# EAGLE design USB-HID (EAGLE 5.11)
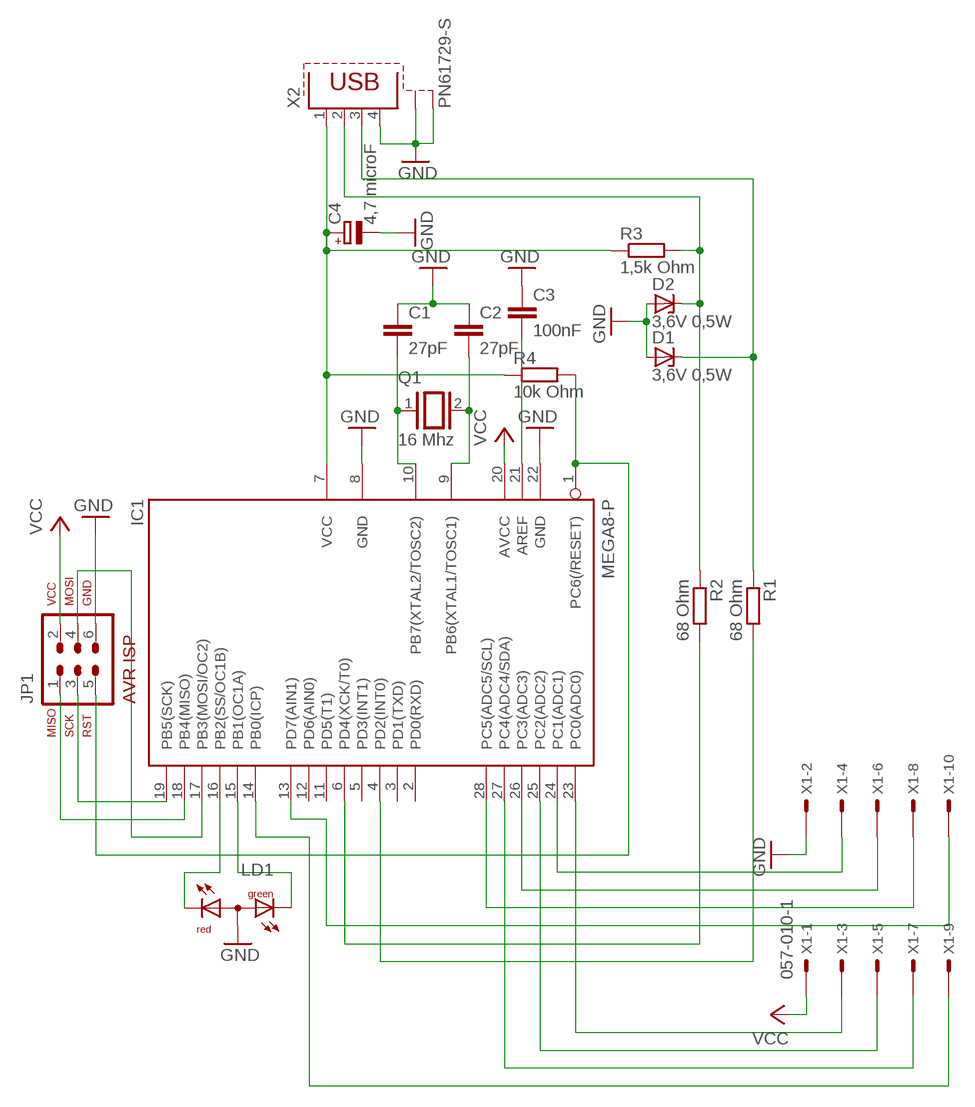
[diagram p0: schematic, sheet 1]

## Parts
C1  27pF  C2.5/2  [C2.5-2]
C2  27pF  C2.5/2  [C2.5-2]
C3  100nF  C2.5/2  [C2.5-2]
C4  4,7 microF  CPOL-EUE1.8-4  [E1,8-4]
D1  3,6V 0,5W  ZPD  [DO35Z10]
D2  3,6V 0,5W  ZPD  [DO35Z10]
IC1  MEGA8-P  [DIL28-3]
JP1  AVR-ISP-6VERT  [AVR-ISP-6]
LD1  DUOLED-RG-A  [DUOLED-A-5MM]
Q1  16 Mhz  XTAL/S  [QS]
R1  68 Ohm  R-EU_0204/7  [0204/7]
R2  68 Ohm  R-EU_0204/7  [0204/7]
R3  1,5k Ohm  R-EU_0204/7  [0204/7]
R4  10k Ohm  R-EU_0204/7  [0204/7]
X1  057-010-1  [057-010-1]
X2  PN61729-S  [PN61729-S]

## Nets
GND: C1.1 C2.1 C3.1 C4.- D1.A D2.A IC1.8(GND) IC1.22(GND) JP1.6 LD1.A X1.2 X2.4 X2.S1 X2.S2
N$1: C3.2 IC1.21(AREF)
N$2: C4.+ IC1.7(VCC) R3.1 R4.1 X2.1
N$4: D2.C R2.1 R3.2 X2.2
N$21: D1.C R1.1 X2.3
PB0: IC1.14(PB0(ICP)) X1.9
PB1: IC1.15(PB1(OC1A)) LD1.CX(CG)
PB2: IC1.16(PB2(SS/OC1B)) LD1.CR
PB3(MOSI): IC1.17(PB3(MOSI/OC2)) JP1.4
PB4(MISO): IC1.18(PB4(MISO)) JP1.1
PB5(SCK): IC1.19(PB5(SCK)) JP1.3
PB6(XTAL1): C2.2 IC1.9(PB6(XTAL1/TOSC1)) Q1.2
PB7(XTAL2): C1.2 IC1.10(PB7(XTAL2/TOSC2)) Q1.1
PC0: IC1.23(PC0(ADC0)) X1.3
PC1: IC1.24(PC1(ADC1)) X1.4
PC2: IC1.25(PC2(ADC2)) X1.5
PC3: IC1.26(PC3(ADC3)) X1.6
PC4: IC1.27(PC4(ADC4/SDA)) X1.7
PC5: IC1.28(PC5(ADC5/SCL)) X1.8
PC6(RESET): IC1.1(PC6(/RESET)) JP1.5 R4.2
PD7: IC1.13(PD7(AIN1)) X1.10
USB_D+: IC1.4(PD2(INT0)) R1.2
USB_D-: IC1.6(PD4(XCK/T0)) R2.2
VCC: IC1.20(AVCC) JP1.2 X1.1
Unconnected: IC1.2(PD0(RXD)) IC1.3(PD1(TXD)) IC1.5(PD3(INT1)) IC1.11(PD5(T1)) IC1.12(PD6(AIN0))

## Library data of the parts
C1-C3 = capacitor-wima:C: CAPACITOR naming: grid - package width
C4 = rcl:CPOL-EU: POLARIZED CAPACITOR, European symbol
D1 D2 = diode:ZPD: Z DIODE 500 mW
IC1 = atmel:MEGA8-P: MICROCONTROLLER 8 Kbytes FLASH, 1 kbytes SRAM, 512 bytes EEPROM, USART, 4-channel 10 bit ADC, 2-channel 8 bit ADC Pin compatible with Atmega48, ATMega88, ATMega168 Source: avr.lbr; OC_FARNELL: unknown; OC_NEWARK: unknown
JP1 = avr-7:AVR-ISP-6: AVR ISP-6 Serial Programming Header
LD1 = led:DUOLED-RG-A: DUO LED 2 colors (red/green), 5 mm, round, common Anode www.ligitek.com or other producers.
Q1 = special:XTAL/S: CRYSTAL
R1-R4 = resistor:R-EU_: RESISTOR, European symbol
X1 = con-panduit:057-010-: CONNECTOR 10-pin series 057 contact pc board low profile headers; OC_FARNELL: unknown; OC_NEWARK: unknown
X2 = con-berg:PN61729-S: BERG USB connector; OC_FARNELL: unknown; OC_NEWARK: unknown

## Board
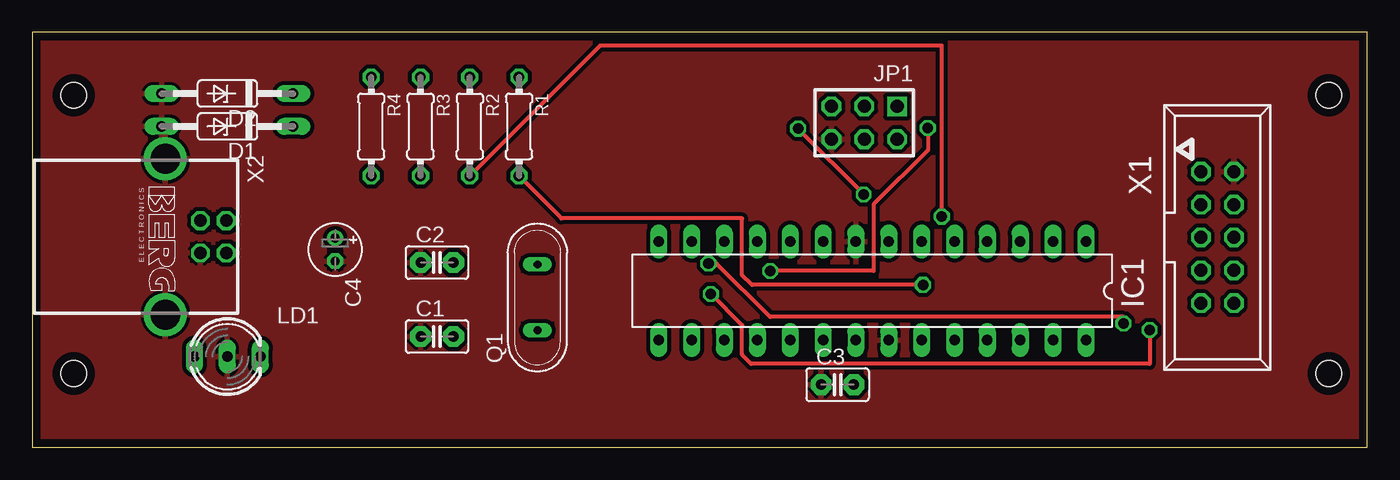
[diagram p1: board, top side]
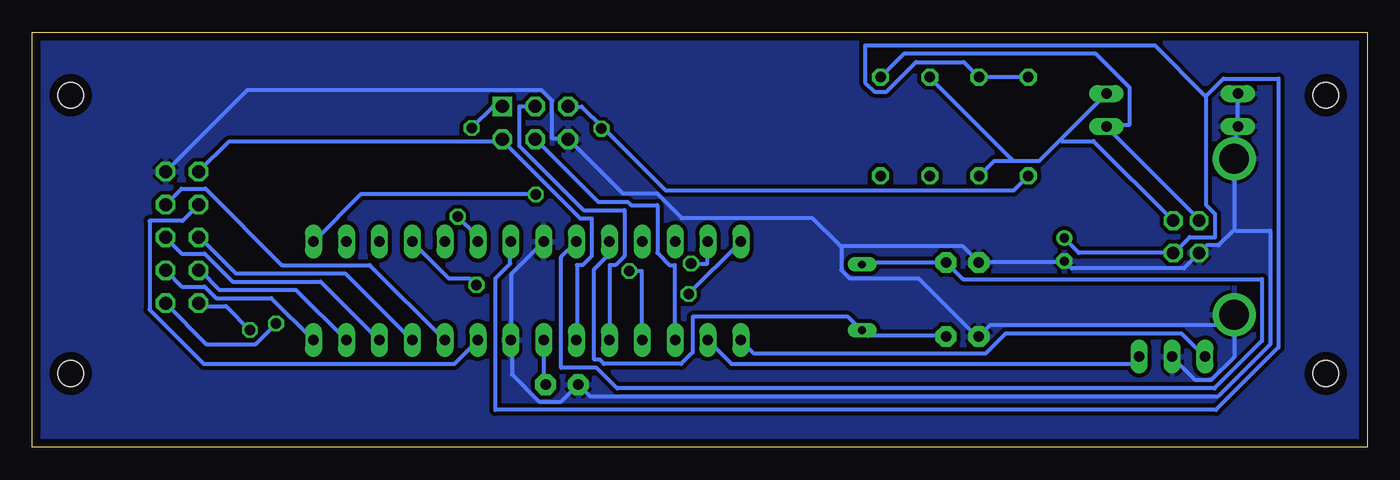
[diagram p2: board, bottom side, seen from below]

Size 103.17 x 32.05 mm. Coordinates in mm from the lower left corner, seen from the top.
Outline: 0,0 103.17,0 103.17,32.05 0,32.05 0,0
Copper layers (1*16): Top 0.035mm / dielectric 1.5mm / Bottom 0.035mm
Design rules: minimum track width 12mil, minimum drill 32mil, track to track 12mil, track to pad 12mil, pad to pad 12mil, via to via 12mil, smd to smd 12mil, copper to edge 25mil, drill to drill 10mil, minimum pad ring 10mil, minimum via ring 8mil, stop-mask expansion 4mil, vias tented up to drill 0mil, thermal gap 10mil
Holes 2 mm at 3.2,5.7 3.2,27.2 100.2,5.7 100.2,27.2
tRestrict: area 22.8,14 to 24,16.5; area 14.4,5.7 to 15.7,8.3; area 17,5.7 to 18.2,8.3; area 11.9,5.7 to 13.2,8.3; area 22.8,14 to 24,16.5; area 37.8,13.5 to 40.3,14.8; area 37.8,8.4 to 40.3,9.7; area 66.2,25.7 to 67.5,27; area 66.2,23.2 to 67.5,24.4; area 63.7,23.2 to 64.9,24.4; area 63.7,25.7 to 64.9,27; area 61.1,25.7 to 62.4,27; 48 more areas
vRestrict: area 36.5,5.9 to 41.6,17.3; area 21.3,13 to 25.8,17.5; area 87,5.4 to 96.2,26.7; area 60,22.2 to 68.6,27.9

### Footprints (pad centres in the part's own frame; a part is rotated, then mirrored left to right if it is on the bottom)
C2.5-2 = drill 0.813 pad 1.6 octagon: 1 -1.27,0; 2 1.27,0
E1,8-4 = drill 0.711 pad 1.168: + -0.889,0 | drill 0.711 pad 1.168 octagon: - 0.889,0
DO35Z10 = drill 0.813 long: A 5.08,0; C -5.08,0
DIL28-3 = drill 0.813 long: 1 -16.51,-3.81; 2 -13.97,-3.81; 3 -11.43,-3.81; 4 -8.89,-3.81; 5 -6.35,-3.81; 6 -3.81,-3.81; 7 -1.27,-3.81; 8 1.27,-3.81; 9 3.81,-3.81; 10 6.35,-3.81; 11 8.89,-3.81; 12 11.43,-3.81; 13 13.97,-3.81; 14 16.51,-3.81; 15 16.51,3.81; 16 13.97,3.81; 17 11.43,3.81; 18 8.89,3.81; 19 6.35,3.81; 20 3.81,3.81; 21 1.27,3.81; 22 -1.27,3.81; 23 -3.81,3.81; 24 -6.35,3.81; 25 -8.89,3.81; 26 -11.43,3.81; 27 -13.97,3.81; 28 -16.51,3.81
AVR-ISP-6 = drill 1.016 square: 1 -2.54,-1.27 | drill 1.016 octagon: 2 -2.54,1.27; 3 0,-1.27; 4 0,1.27; 5 2.54,-1.27; 6 2.54,1.27
DUOLED-A-5MM = drill 0.813 long: A 0,0; CR 2.54,0; CX -2.54,0
QS = drill 0.61 long: 1 -2.54,0; 2 2.54,0
0204/7 = drill 0.813 octagon: 1 -3.81,0; 2 3.81,0
057-010-1 = drill 1 octagon: 1 -5.08,-1.27; 2 -5.08,1.27; 3 -2.54,-1.27; 4 -2.54,1.27; 5 0,-1.27; 6 0,1.27; 7 2.54,-1.27; 8 2.54,1.27; 9 5.08,-1.27; 10 5.08,1.27
PN61729-S = drill 0.95 octagon: 1 1.25,4.71; 2 -1.25,4.71; 3 -1.25,2.71; 4 1.25,2.71 | drill 2.3 pad 2.9: S1 -6.02,0; S2 6.02,0

### Placement (x,y rotation side)
C1  31.28,8.55 0 top
C2  31.28,14.27 0 top
C3  62.23,4.84 0 top
C4  23.4,15.27 270 top
D1  15.08,24.78 180 top
D2  15.08,27.32 180 top
IC1  64.92,12.08 180 top
JP1  64.3,25.07 180 top
LD1  15.08,7 0 top
Q1  39.04,11.58 90 top
R1  37.62,24.78 270 top
R2  33.81,24.78 270 top
R3  30,24.78 270 top
R4  26.19,24.78 270 top
X1  91.59,16.21 270 top
X2  10.28,16.26 270 top

### Tracks (layer width: path | path; a pad name or v marks a point on that pad's centre or on a via)
GND
  Bottom 0.305: X1.2 92.84,21.31 86.55,27.59 63.82,27.59 62.99,26.77 62.99,23.85 61.78,23.85 JP1.6 61.66,23.72 57.53,19.59 54.86,19.59 52.96,17.69 42.86,17.69 40.77,15.59 40.64,15.53 | LD1.A 15.05,6.96 13.27,5.18 12.06,5.18 10.29,6.96 10.29,10.2 X2.S2 10.41,9.43 29.15,9.43 29.97,8.61 C1.1 30.16,8.54 34.67,13.05 40,13.05 40.64,13.69 40.64,15.53 | IC1.8 63.69,15.85 66.17,13.37 66.17,8.29 IC1.22 66.1,8.16 66.1,5.62 64.01,3.53 62.29,3.53 61.02,4.8 C3.1 60.83,4.73 60.01,3.91 11.56,3.91 7.49,7.97 7.49,16.74 10.16,16.74 10.29,16.8 | D2.A 10.03,27.28 10.03,24.8 D1.A 10.1,24.67 10.1,22.39 10.22,22.39 X2.S1 10.29,22.26 10.29,16.8 | 10.29,16.8 11.49,15.59 12.38,15.59 12.95,15.02 X2.4 13.08,14.89 14.16,13.82 22.86,13.82 23.3,14.26 C4.- 23.43,14.32 29.97,14.32 C2.1 30.1,14.39 31.24,15.53 40.64,15.53
  pour Bottom: -5.55,37.51 111.86,37.51 111.86,-11.99 -5.57,-11.99 -5.57,37.59
  pour Top: -1.87,34.14 107.23,34.14 107.23,-7.11 -1.79,-7.11
N$1
  Bottom 0.305: IC1.21 63.63,8.23 63.63,4.86 63.56,4.86 C3.2
N$2
  Bottom 0.305: R4.1 26.23,28.61 29.97,28.61 R3.1 30.1,28.67 31.18,29.75 34.86,29.75 37.15,27.47 38.1,27.47 38.8,28.17 38.8,31.02 16.38,31.02 12.57,27.21 12.45,27.15 | C4.+ 23.37,16.1 22.29,15.02 15.05,15.02 X2.1 14.86,15.08 13.72,16.23 11.75,16.23 11.75,18.01 12.45,18.7 12.45,27.15 | 12.45,27.15 11.11,28.48 6.86,28.48 6.86,7.72 11.68,2.89 67.37,2.89 67.37,13.05 66.23,14.2 66.23,15.85 IC1.7
N$4
  Bottom 0.305: 23.72,23.75 25.34,22.13 27.5,22.13 | 23.72,23.75 20.19,27.28 D2.C | 27.5,22.13 28.83,22.13 29.97,20.99 R3.2 | R2.1 33.78,28.55 27.5,22.26 27.5,22.13 | X2.2 15.05,17.56 21.14,23.66 23.62,23.66 23.72,23.75
N$21
  Bottom 0.305: X2.3 12.95,17.56 20.13,24.74 D1.C 20.13,24.93 18.35,24.93 18.35,27.79 20.95,30.39 35.81,30.39 37.59,28.61 R1.1
PB0  (via drill 0.81)
  Top 0.305: v52.45,11.85 54.86,9.43 54.86,7.15 55.56,6.45 86.36,6.45 v86.36,9.05
  Bottom 0.305: v52.45,11.85 48.45,15.85 IC1.14 | v86.36,9.05 88.2,10.89 90.11,10.89 90.3,11.08 X1.9
PB1
  Bottom 0.305: LD1.CX 12.57,7.02 14.35,8.8 27.94,8.8 29.46,7.27 47.43,7.27 48.39,8.23 IC1.15
PB2
  Bottom 0.305: LD1.CR 17.65,6.96 18.16,6.45 49.15,6.45 50.93,8.23 IC1.16
PB3(MOSI)
  Bottom 0.305: IC1.17 53.53,8.29 53.53,14.07 53.91,14.07 54.86,15.02 54.86,18.7 56.89,18.7 57.15,18.96 59.44,18.96 64.26,23.78 JP1.4
PB4(MISO)  (via drill 0.81)
  Top 0.305: v57.02,13.62 65.02,13.62 65.02,18.77 69.21,22.96 v69.21,24.67
  Bottom 0.305: v57.02,13.62 56.07,13.62 56.07,8.29 IC1.18 | v69.21,24.67 67.56,26.32 66.86,26.32 JP1.1
PB5(SCK)
  Bottom 0.305: IC1.19 58.55,8.29 58.55,14.07 58.1,14.07 57.4,14.77 57.4,18.32 60.58,18.32 65.53,23.28 65.53,26.32 64.33,26.32 JP1.3
PB6(XTAL1)
  Bottom 0.305: Q1.2 38.99,14.13 38.86,14.26 32.58,14.26 C2.2 32.45,14.2 31.24,12.99 8.13,12.99 8.13,8.23 11.81,4.54 57.97,4.54 59.56,6.13 62.29,6.13 62.29,14.7 61.15,15.85 IC1.9
PB7(XTAL2)
  Bottom 0.305: C1.2 32.58,8.61 38.61,8.61 38.99,8.99 Q1.1 39.18,9.12 40.13,10.07 52.13,10.07 52.13,7.34 53.02,6.45 58.99,6.45 59.31,6.77 59.75,6.77 59.75,13.75 58.8,14.7 58.61,14.7 58.61,15.85 IC1.10
PC0
  Bottom 0.305: IC1.23 68.77,8.23 70.55,6.45 89.92,6.45 94.11,10.64 94.11,17.5 91.57,17.5 90.36,18.7 X1.3
PC1
  Bottom 0.305: IC1.24 71.31,8.29 77.09,14.07 83.88,14.07 89.79,19.97 91.63,19.97 92.84,18.77 X1.4
PC2
  Bottom 0.305: IC1.25 73.85,8.29 78.99,13.43 87.44,13.43 90.17,16.16 90.3,16.16 X1.5
PC3
  Bottom 0.305: IC1.26 76.39,8.29 80.9,12.8 87.69,12.8 89.85,14.96 91.63,14.96 92.84,16.16 X1.6
PC4
  Bottom 0.305: IC1.27 78.93,8.29 82.8,12.16 88.71,12.16 90.17,13.62 90.3,13.62 X1.7
PC5
  Bottom 0.305: IC1.28 81.47,8.29 84.71,11.53 88.96,11.53 89.85,12.42 91.63,12.42 92.84,13.62 X1.8
PC6(RESET)  (via drill 0.81)
  Top 0.305: v59.18,24.61 v64.26,19.53
  Bottom 0.305: 59.09,24.71 60.7,26.32 61.72,26.32 JP1.5 | 59.09,24.71 54.23,19.85 27.3,19.85 26.23,20.93 R4.2 | v64.26,19.53 77.79,19.53 81.41,15.91 IC1.1 | v59.18,24.61 59.09,24.71
PD7  (via drill 0.81)
  Top 0.305: v52.26,14.2 52.9,14.2 57.02,10.07 84.33,10.07 v84.33,9.56
  Bottom 0.305: v52.26,14.2 50.99,14.2 50.99,15.85 IC1.13 | v84.33,9.56 85.92,7.97 89.72,7.97 92.84,11.08 X1.10
USB_D+  (via drill 0.81)
  Top 0.305: v68.83,12.55 55.63,12.55 54.86,13.31 54.86,17.69 40.89,17.69 37.66,20.93 R1.2
  Bottom 0.305: v68.83,12.55 69.34,13.05 70.99,13.05 73.79,15.85 IC1.4
USB_D-  (via drill 0.81)
  Top 0.305: v70.29,17.82 70.29,31.02 43.88,31.02 33.84,20.99 R2.2
  Bottom 0.305: v70.29,17.82 68.77,16.29 68.77,15.91 IC1.6
VCC
  Bottom 0.305: IC1.20 61.09,8.29 61.09,14.07 60.64,14.07 59.94,14.77 59.94,17.69 60.83,17.69 66.8,23.66 66.8,23.78 JP1.2 66.93,23.59 88.01,23.59 90.3,21.31 X1.1